# Altium schematic sheet PiHAT_Sensor.SchDoc
size A4
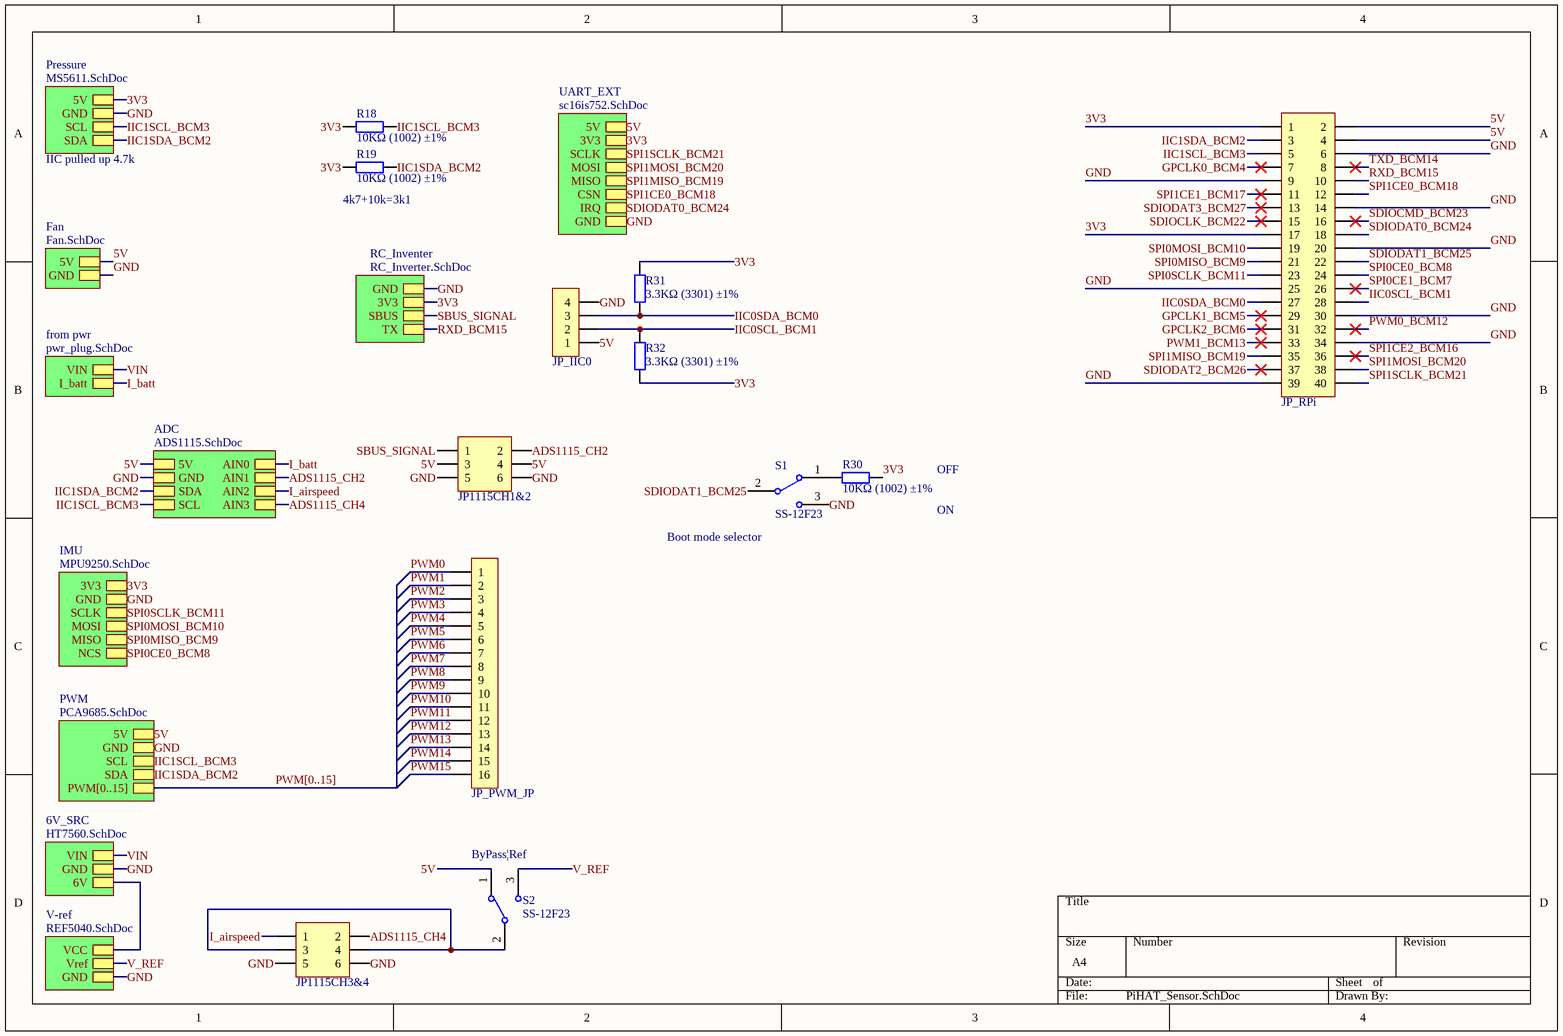
[diagram p0: PiHAT_Sensor.SchDoc]

## Parts
JP1115CH1&2  Header3X2  [HDR2.54-WI-2x3P]  (value not drawn)
JP1115CH3&4  Header3X2  [HDR2.54-WI-2x3P]  (value not drawn)
JP_IIC0  HDR-1X4  [MX 1.25-WS-4P]  (value not drawn)
JP_PWM_JP  HDR-1X16  [HDR2.54-LI-16P]  (value not drawn)
JP_RPi  Header 2X11  [HDR2.54-LI-2x20P]  (value not drawn)
R18  10KΩ (1002) ±1%  [0402_R]
R19  10KΩ (1002) ±1%  [0402_R]
R30  10KΩ (1002) ±1%  [0402_R]
R31  3.3KΩ (3301) ±1%  [0402_R]
R32  3.3KΩ (3301) ±1%  [0402_R]
S1  SS-12F23  [MSK-12C01-07]
S2  SS-12F23  [MSK-12C01-07]

## Sub-sheets
6V_SRC = HT7560.SchDoc: 6V, GND, VIN
ADC = ADS1115.SchDoc: SDA, AIN0, AIN3, AIN1, AIN2, 5V, GND, SCL
Fan = Fan.SchDoc: 5V, GND
from pwr = pwr_plug.SchDoc: I_batt, VIN
IMU = MPU9250.SchDoc: NCS, 3V3, GND, SCLK, MOSI, MISO
Pressure = MS5611.SchDoc: 5V, SCL, GND, SDA
PWM = PCA9685.SchDoc: PWM[0..15], SDA, SCL, GND, 5V
RC_Inventer = RC_Inverter.SchDoc: GND, TX, 3V3, SBUS
UART_EXT = sc16is752.SchDoc: CSN, 5V, SCLK, 3V3, GND, IRQ, MOSI, MISO
V-ref = REF5040.SchDoc: VCC, Vref, GND

## Nets
3V3: JP_RPi.1 JP_RPi.17 R18.1 R19.1 R30.2 R31.2 R32.1 ; sheet Pressure/5V, sheet IMU/3V3, sheet RC_Inventer/3V3, sheet UART_EXT/3V3
5V: JP1115CH1&2.3 JP1115CH1&2.4 JP_IIC0.1 JP_RPi.2 JP_RPi.4 S2.1 ; sheet Fan/5V, sheet ADC/5V, sheet PWM/5V, sheet UART_EXT/5V
ADS1115_CH2: JP1115CH1&2.2 ; sheet ADC/AIN1
ADS1115_CH4: JP1115CH3&4.2 ; sheet ADC/AIN3
GND: JP1115CH1&2.5 JP1115CH1&2.6 JP1115CH3&4.5 JP1115CH3&4.6 JP_IIC0.4 JP_RPi.6 JP_RPi.9 JP_RPi.14 JP_RPi.20 JP_RPi.25 JP_RPi.30 JP_RPi.34 JP_RPi.39 S1.3 ; sheet Fan/GND, sheet V-ref/GND, sheet Pressure/GND, sheet ADC/GND, sheet IMU/GND, sheet PWM/GND, sheet RC_Inventer/GND, sheet UART_EXT/GND, sheet 6V_SRC/GND
GPCLK0_BCM4: JP_RPi.7
GPCLK1_BCM5: JP_RPi.29
GPCLK2_BCM6: JP_RPi.31
I_airspeed: JP1115CH3&4.1 ; sheet ADC/AIN2
I_batt: sheet from pwr/I_batt, sheet ADC/AIN0
IIC0SCL_BCM1: JP_IIC0.2 JP_RPi.28 R32.2
IIC0SDA_BCM0: JP_IIC0.3 JP_RPi.27 R31.1
IIC1SCL_BCM3: JP_RPi.5 R18.2 ; sheet Pressure/SCL, sheet ADC/SCL, sheet PWM/SCL
IIC1SDA_BCM2: JP_RPi.3 R19.2 ; sheet Pressure/SDA, sheet ADC/SDA, sheet PWM/SDA
PWM0: JP_PWM_JP.1
PWM0_BCM12: JP_RPi.32
PWM1: JP_PWM_JP.2
PWM1_BCM13: JP_RPi.33
PWM2: JP_PWM_JP.3
PWM3: JP_PWM_JP.4
PWM4: JP_PWM_JP.5
PWM5: JP_PWM_JP.6
PWM6: JP_PWM_JP.7
PWM7: JP_PWM_JP.8
PWM8: JP_PWM_JP.9
PWM9: JP_PWM_JP.10
PWM10: JP_PWM_JP.11
PWM11: JP_PWM_JP.12
PWM12: JP_PWM_JP.13
PWM13: JP_PWM_JP.14
PWM14: JP_PWM_JP.15
PWM15: JP_PWM_JP.16
RXD_BCM15: JP_RPi.10 ; sheet RC_Inventer/TX
SBUS_SIGNAL: JP1115CH1&2.1 ; sheet RC_Inventer/SBUS
SDIOCLK_BCM22: JP_RPi.15
SDIOCMD_BCM23: JP_RPi.16
SDIODAT0_BCM24: JP_RPi.18 ; sheet UART_EXT/IRQ
SDIODAT1_BCM25: JP_RPi.22 S1.2
SDIODAT2_BCM26: JP_RPi.37
SDIODAT3_BCM27: JP_RPi.13
SPI0CE0_BCM8: JP_RPi.24 ; sheet IMU/NCS
SPI0CE1_BCM7: JP_RPi.26
SPI0MISO_BCM9: JP_RPi.21 ; sheet IMU/MISO
SPI0MOSI_BCM10: JP_RPi.19 ; sheet IMU/MOSI
SPI0SCLK_BCM11: JP_RPi.23 ; sheet IMU/SCLK
SPI1CE0_BCM18: JP_RPi.12 ; sheet UART_EXT/CSN
SPI1CE1_BCM17: JP_RPi.11
SPI1CE2_BCM16: JP_RPi.36
SPI1MISO_BCM19: JP_RPi.35 ; sheet UART_EXT/MISO
SPI1MOSI_BCM20: JP_RPi.38 ; sheet UART_EXT/MOSI
SPI1SCLK_BCM21: JP_RPi.40 ; sheet UART_EXT/SCLK
TXD_BCM14: JP_RPi.8
V_REF: S2.3 ; sheet V-ref/Vref
VIN: sheet from pwr/VIN, sheet 6V_SRC/VIN
NetJP1115CH3&4_3: JP1115CH3&4.3 JP1115CH3&4.4 S2.2
NetR30_1: R30.1 S1.1
(unnamed): sheet V-ref/VCC, sheet 6V_SRC/6V

## Buses and harness runs
bus PWM[0..15] = sheet PWM/PWM[0..15]

## Notes on the sheet
- IIC pulled up 4.7k
- (near R19) 4k7+10k=3k1
- OFF
- ON
- (near S1) Boot mode selector
- (near S2) ByPass|Ref

## Library data of the parts
JP1115CH1&2 JP1115CH3&4 = Header 3X2: 3*2P接插件; 版权归属: 源创客; BOM名称: 3*2P接插件; 学习资源: www.ooocke.com
JP_IIC0 = Header 4: 4P接插件; 版权归属: 源创客; BOM名称: 4P接插件; 学习资源: www.ooocke.com
JP_PWM_JP = Header 16: 16P接插件; 版权归属: 源创客; BOM名称: 16P接插件; 学习资源: www.ooocke.com
JP_RPi = Header 20X2: 20*2P接插件; 版权归属: 源创客; BOM名称: 20*2P接插件; 学习资源: www.ooocke.com
R18 R19 R30 = 0402 10KΩ (1002) 1%: 贴片电阻; ComponentLink1Description: 供应商链接; ComponentLink1URL: http://www.szlcsc.com/product/details_26487.html; Package: 0402; Supplier: LC; SuppliersPartNumber: C25744
R31 R32 = 0402 3.3KΩ (3301) 1%: 贴片电阻; ComponentLink1Description: 供应商链接; ComponentLink1URL: http://www.szlcsc.com/product/details_26633.html; Package: 0402; Supplier: LC; SuppliersPartNumber: C25890
S1 S2 = SSW-1P: 1路波动开关; BOM名称: 波动开关; 版权归属: 源创客; 学习资源: www.ooocke.com